# Altium schematic sheet ESP32_Component.SchDoc
size A3; SheetNumber: 1; SheetTotal: 1
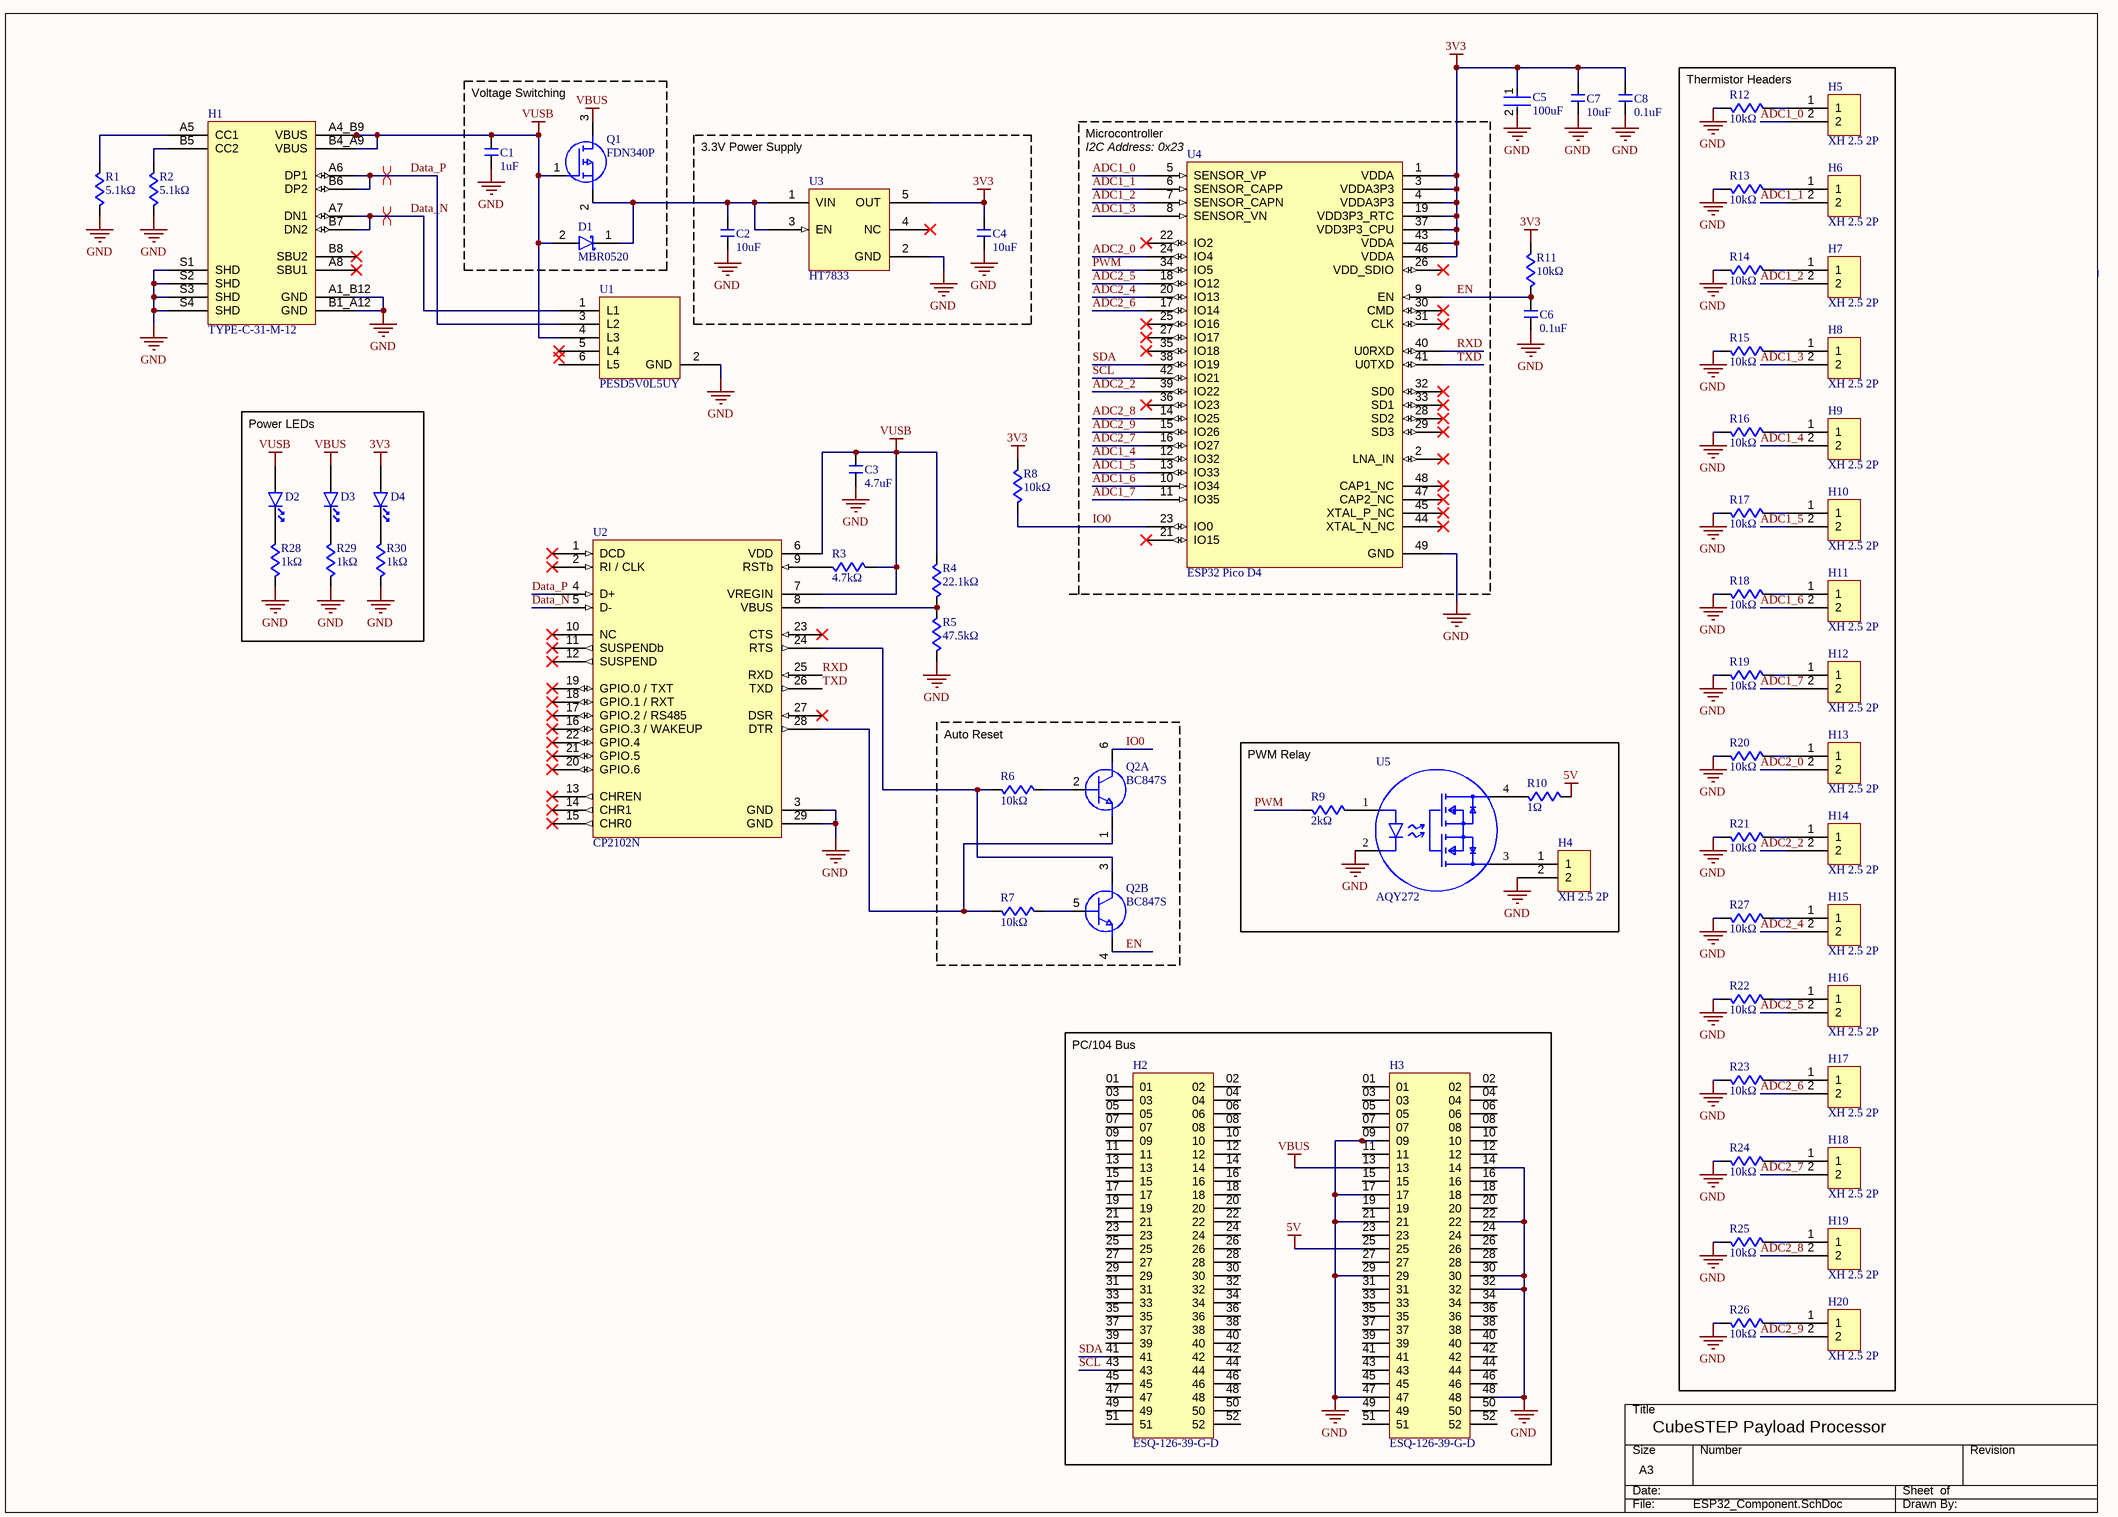
[diagram p0: ESP32_Component.SchDoc]

## Parts
C1  1uF  [FP-GRM155-0_05-MFG]
C2  10uF  [FP-GRM21B-0_1-MFG]
C3  4.7uF  [TCC0402X5R104M160AT-Footprint-1]
C4  10uF  [FP-GRM21B-0_1-MFG]
C5  100uF  [CAPC3216X16N]
C6  0.1uF  [TCC0402X5R104M160AT-Footprint-1]
C7  10uF  [FP-GRM21B-0_1-MFG]
C8  0.1uF  [TCC0402X5R104M160AT-Footprint-1]
D1  MBR0520  [FP-425-04-MFG]
D2  NCD0603R2  [LED0603]  (value not drawn)
D3  NCD0603R2  [LED0603]  (value not drawn)
D4  NCD0603R2  [LED0603]  (value not drawn)
H1  TYPE-C-31-M-12  [TYPE-C-31-M-12-Footprint-1]
H2  ESQ-126-39-G-D  [ESQ-126-39-G-D-Footprint-1]
H3  ESQ-126-39-G-D  [ESQ-126-39-G-D-Footprint-1]
H4  XH 2.5 2P  [W-2501R02P-N000-Footprint-1]
H5  XH 2.5 2P  [W-2501R02P-N000-Footprint-1]
H6  XH 2.5 2P  [W-2501R02P-N000-Footprint-1]
H7  XH 2.5 2P  [W-2501R02P-N000-Footprint-1]
H8  XH 2.5 2P  [W-2501R02P-N000-Footprint-1]
H9  XH 2.5 2P  [W-2501R02P-N000-Footprint-1]
H10  XH 2.5 2P  [W-2501R02P-N000-Footprint-1]
H11  XH 2.5 2P  [W-2501R02P-N000-Footprint-1]
H12  XH 2.5 2P  [W-2501R02P-N000-Footprint-1]
H13  XH 2.5 2P  [W-2501R02P-N000-Footprint-1]
H14  XH 2.5 2P  [W-2501R02P-N000-Footprint-1]
H15  XH 2.5 2P  [W-2501R02P-N000-Footprint-1]
H16  XH 2.5 2P  [W-2501R02P-N000-Footprint-1]
H17  XH 2.5 2P  [W-2501R02P-N000-Footprint-1]
H18  XH 2.5 2P  [W-2501R02P-N000-Footprint-1]
H19  XH 2.5 2P  [W-2501R02P-N000-Footprint-1]
H20  XH 2.5 2P  [W-2501R02P-N000-Footprint-1]
Q1  FDN340P  [FDN340P-Footprint-1]
Q2  BC847S  [BC847S-Footprint-1]  (parts A,B of 2)
R1  5.1kΩ  [RESC1005X04N]
R2  5.1kΩ  [RESC1005X04N]
R3  4.7kΩ  [RESC1005X04N]
R4  22.1kΩ  [RESC1005X04N]
R5  47.5kΩ  [RESC1005X04N]
R6  10kΩ  [RESC1005X04N]
R7  10kΩ  [RESC1005X04N]
R8  10kΩ  [RESC1005X04N]
R9  2kΩ  [RESC1005X04N]
R10  1Ω  [RESC5025X04N]
R11  10kΩ  [RESC1005X04N]
R12  10kΩ  [RESC1005X04N]
R13  10kΩ  [RESC1005X04N]
R14  10kΩ  [RESC1005X04N]
R15  10kΩ  [RESC1005X04N]
R16  10kΩ  [RESC1005X04N]
R17  10kΩ  [RESC1005X04N]
R18  10kΩ  [RESC1005X04N]
R19  10kΩ  [RESC1005X04N]
R20  10kΩ  [RESC1005X04N]
R21  10kΩ  [RESC1005X04N]
R22  10kΩ  [RESC1005X04N]
R23  10kΩ  [RESC1005X04N]
R24  10kΩ  [RESC1005X04N]
R25  10kΩ  [RESC1005X04N]
R26  10kΩ  [RESC1005X04N]
R27  10kΩ  [RESC1005X04N]
R28  1kΩ  [RESC1005X04N]
R29  1kΩ  [RESC1005X04N]
R30  1kΩ  [RESC1005X04N]
U1  PESD5V0L5UY  [PESD5V0L5UY-Footprint-1]
U2  CP2102N  [CP2102N-A02-GQFN28R-Footprint-1]
U3  HT7833  [HT7833-Footprint-1]
U4  ESP32 Pico D4  [ESP32-PICO-D4-Footprint-1]
U5  AQY272  [FP-AQY272-MFG]

## Blocks framed on the sheet
Thermistor Headers: H5-H20 R12-R27
Voltage Switching: C1 D1 Q1
3.3V Power Supply: C2 C4 U3
Power LEDs: D2-D4 R28-R30
Auto Reset: Q2 R6 R7
PWM Relay: H4 R9 R10 U5
PC/104 Bus: H2 H3

## Nets
3V3: C4.2 C5.1 C7.2 C8.2 D4.2(A) R8.2 R11.2 U3.5(OUT) U4.1(VDDA) U4.3(VDDA3P3) U4.4(VDDA3P3) U4.19(VDD3P3_RTC) U4.37(VDD3P3_CPU) U4.43(VDDA) U4.46(VDDA)
5V: H3.25 R10.2
GND: C1.2 C2.1 C3.2 C4.1 C5.2 C6.1 C7.1 C8.1 H1.A1_B12(GND) H1.B1_A12(GND) H1.S1(SHD) H1.S2(SHD) H1.S3(SHD) H1.S4(SHD) H3.09 H3.14 H3.17 H3.21 H3.22 H3.29 H3.30 H3.32 H3.47 H3.48 H4.2 R1.1 R2.1 R5.1 R12.2 R13.1 R14.1 R15.1 R16.1 R17.1 R18.1 R19.1 R20.1 R21.1 R22.1 R23.1 R24.1 R25.1 R26.1 R27.1 R28.1 R29.1 R30.1 U1.2(GND) U2.3(GND) U2.29(GND) U3.2(GND) U4.49(GND) U5.2(C)
VBUS: D3.2(A) H3.13 Q1.3(D)
VUSB: C1.1 C3.1 D1.2(A) D2.2(A) H1.A4_B9(VBUS) H1.B4_A9(VBUS) Q1.1(G) R3.2 R4.2 U1.4(L3) U2.6(VDD) U2.7(VREGIN)
ADC1_0: H5.2 U4.5(SENSOR_VP)
ADC1_1: H6.2 U4.6(SENSOR_CAPP)
ADC1_2: H7.2 U4.7(SENSOR_CAPN)
ADC1_3: H8.2 U4.8(SENSOR_VN)
ADC1_4: H9.2 U4.12(IO32)
ADC1_5: H10.2 U4.13(IO33)
ADC1_6: H11.2 U4.10(IO34)
ADC1_7: H12.2 U4.11(IO35)
ADC2_0: H13.2 U4.24(IO4)
ADC2_2: H14.2 U4.39(IO22)
ADC2_4: H15.2 U4.20(IO13)
ADC2_5: H16.2 U4.18(IO12)
ADC2_6: H17.2 U4.17(IO14)
ADC2_7: H18.2 U4.16(IO27)
ADC2_8: H19.2 U4.14(IO25)
ADC2_9: H20.2 U4.15(IO26)
Data_N: H1.A7(DN1) H1.B7(DN2) U1.1(L1) U2.5(D-)
Data_P: H1.A6(DP1) H1.B6(DP2) U1.3(L2) U2.4(D+)
EN: C6.2 Q2.4(S) R11.1 U4.9(EN)
IO0: Q2.6(D) R8.1 U4.23(IO0)
PWM: R9.1 U4.34(IO5)
RXD: U2.25(RXD) U4.40(U0RXD)
SCL: H2.43 U4.42(IO21)
SDA: H2.41 U4.38(IO19)
TXD: U2.26(TXD) U4.41(U0TXD)
NetC2_2: C2.2 D1.1(C) Q1.2(S) U3.1(VIN) U3.3(EN)
NetD2_1: D2.1(C) R28.2
NetD3_1: D3.1(C) R29.2
NetD4_1: D4.1(C) R30.2
NetH1_A5: H1.A5(CC1) R1.2
NetH1_B5: H1.B5(CC2) R2.2
NetH4_1: H4.1 U5.3(1_DRAIN)
NetH5_1: H5.1 R12.1
NetH6_1: H6.1 R13.2
NetH7_1: H7.1 R14.2
NetH8_1: H8.1 R15.2
NetH9_1: H9.1 R16.2
NetH10_1: H10.1 R17.2
NetH11_1: H11.1 R18.2
NetH12_1: H12.1 R19.2
NetH13_1: H13.1 R20.2
NetH14_1: H14.1 R21.2
NetH15_1: H15.1 R27.2
NetH16_1: H16.1 R22.2
NetH17_1: H17.1 R23.2
NetH18_1: H18.1 R24.2
NetH19_1: H19.1 R25.2
NetH20_1: H20.1 R26.2
NetQ2_1: Q2.1(S) R7.2 U2.28(DTR)
NetQ2_2: Q2.2(G) R6.1
NetQ2_3: Q2.3(D) R6.2 U2.24(RTS)
NetQ2_5: Q2.5(G) R7.1
NetR3_1: R3.1 U2.9(RSTb)
NetR4_1: R4.1 R5.2 U2.8(VBUS)
NetR9_2: R9.2 U5.1(A)
NetR10_1: R10.1 U5.4(2_DRAIN)

Not connected (* = marked no-connect by the designer): H1 A8(SBU1)* B8(SBU2)*; H2 01 02 03 04 05 06 07 08 09 10 11 12 13 14 15 16 17 18 19 20 21 22 23 24 25 26 27 28 29 30 31 32 33 34 35 36 37 38 39 40 42 44 45 46 47 48 49 50 51 52; H3 01 02 03 04 05 06 07 08 10 11 12 15 16 18 19 20 23 24 26 27 28 31 33 34 35 36 37 38 39 40 41 42 43 44 45 46 49 50 51 52; U1 5(L4)* 6(L5); U2 1(DCD)* 2(RI_/_CLK)* 10(NC)* 11(SUSPENDb)* 12(SUSPEND)* 13(CHREN)* 14(CHR1)* 15(CHR0)* 16(GPIO.3_/_WAKEUP)* 17(GPIO.2_/_RS485)* 18(GPIO.1_/_RXT)* 19(GPIO.0_/_TXT)* 20(GPIO.6)* 21(GPIO.5)* 22(GPIO.4)* 23(CTS)* 27(DSR)*; U3 4(NC)*; U4 2(LNA_IN)* 21(IO15)* 22(IO2)* 25(IO16)* 26(VDD_SDIO)* 27(IO17)* 28(SD2)* 29(SD3)* 30(CMD)* 31(CLK)* 32(SD0)* 33(SD1)* 35(IO18)* 36(IO23)* 44(XTAL_N_NC)* 45(XTAL_P_NC)* 47(CAP2_NC)* 48(CAP1_NC)*

## Layout directives
differential pair: Data_N, Data_P

## Notes on the sheet
- (near U4) Microcontroller
- (near U4) I2C Address: 0x23
- CubeSTEP Payload Processor
- DWG. NO.
- REV.
- SHT.
- REVISION
- DESCRIPTION
- DATE
- APPROVED
- THIS DOCUMENT AND THE DATA DISCLOSED HEREIN OR HEREWITH IS THE PROPERTY OF ALTIUM LIMITED AND MAY BE FREELY DISTRIBUTED IN WHOLE. NO RIGHTS ARE RESERVED OR EXPRESS OR IMPLIED WARANTEE GIVEN.
- ENG:
- DSN:
- APPROVALS
- PROJECT
- DOCUMENT REVISION:
- DESIGN ITEM:
- CHK:
- BOM:
- REFERENCE DOCUMENTS
- PROJECT REVISION:
- TITLE
- FAB DWG:
- PCB DWG:
- ASSY DWG:
- SCALE:
- SIZE
- C
- CAGE CODE
- FILE NAME
- DWG NO.
- SHEET
- OF
- REV

## Library data of the parts
C1 = CMP-00014-3: ±10% 16V X5R SMD 0402; Manufacturer: Murata Electronics; Part Number: GRM155R61C105KA12D; Type: Ceramic; Size Code: 0402; Tolerance: ±10%; Max Operating Temperature: 85°C; Capacitance: 1uF; Mount: Surface Mount; Temperature Coefficient: X5R; Overload Voltage: 16V; ComponentLink1URL: https://jlcpcb.com/partdetail/MurataElectronics-GRM155R61C105KA12D/C77006; Min Operating Temperature: -55°C; ComponentLink1Description: JLCPCB
C2 C4 C7 = CMP-00013-3: ±10% 16V B SMD 0805; Part Number: GRM21BB31C106KE15L; Manufacturer: Murata Electronics; Type: Ceramic; ComponentLink1URL: https://jlcpcb.com/partdetail/173698-GRM21BB31C106KE15L/C162317; Max Operating Temperature: 85°C; Capacitance: 10uF; ComponentLink1Description: JLCPCB; Temperature Coefficient: B; Mount: Surface Mount; Tolerance: ±10%; Overload Voltage: 16V; Min Operating Temperature: -25°C; Size Code: 0805
C3 = CMP-00010-8: ±20% 16V X5R SMD 0402; Type: Ceramic; Capacitance: 4.7uF; ComponentLink1Description: JLCPCB; Overload Voltage: 16V; ComponentLink1URL: https://jlcpcb.com/partdetail/-CM05X5R475M16AH/C255498; Tolerance: ±20%; Manufacturer: --; Size Code: 0402; Temperature Coefficient: X5R; Max Operating Temperature: 85°C; Part Number: CM05X5R475M16AH; Min Operating Temperature: -55°C; Mount: Surface Mount
C5 = CMP-00012-3: ±20% 6.3V X5R SMD 1206; Part Number: JMK316BJ107ML-T; Manufacturer: Taiyo Yuden; Type: Ceramic; Capacitance: 100uF; Tolerance: ±20%; ComponentLink1URL: https://jlcpcb.com/partdetail/TaiyoYuden-JMK316BJ107MLT/C87164; Size Code: 1206; Overload Voltage: 6.3V; Max Operating Temperature: 85°C; Mount: Surface Mount; Min Operating Temperature: -55°C; Temperature Coefficient: X5R; ComponentLink1Description: JLCPCB
C6 C8 = CMP-00011-4: ±20% 16V X5R SMD 0402; Part Number: TCC0402X5R104M160AT; Manufacturer: CCTC; Type: Ceramic; Mount: Surface Mount; Max Operating Temperature: 85°C; ComponentLink1URL: https://jlcpcb.com/partdetail/Cctc-TCC0402X5R104M160AT/C344190; Overload Voltage: 16V; Size Code: 0402; Capacitance: 0.1uF; ComponentLink1Description: JLCPCB; Min Operating Temperature: -55°C; Tolerance: ±20%; Temperature Coefficient: X5R
D1 = CMP-00018-4: Rectifier Diode, Schottky, 1 Phase, 1 Element, 0.5A, 20V V(RRM), Silicon; Number of Elements: 1; Forward Voltage-Max (VF): 385mV; Package Body Material: Plastic; Qualification Status: Not Qualified; Max Output Current: 500mA; Non-rep Pk Forward Current-Max: 5.5A; Time @ Peak Reflow Temperature-Max (s): 30s; Additional Feature: FREE WHEELING DIODE; Package Shape: Rectangular; Min Operating Temperature: -65°C; Terminal Finish: Tin; Package Style: SMALL OUTLINEMeter; Number of Pins: 2; Terminal Form: Gull Wing; Technology: SCHOTTKY; RoHS Compliant: Yes; Diode Type: RECTIFIER; Max Operating Temperature: 125°C; Moisture Sensitivity Level: 1; JESD-609 Code: e3; Peak Reflow Temperature (Cel): 260°C; JESD-30 Code: R-PDSO-G2; Surface Mount: Yes; Reach SVHC Compliant: Yes; Terminal Position: DUAL; Diode Element Material: SILICON; Rep Pk Reverse Voltage-Max: 20V
D2-D4 = CMP-00019-4: Colorless transparence 65mcd~150mcd 615nm~630nm -30℃~+85℃ Red 130° 65mW 0603 Light Emitting Diodes (LED) ROHS; Forward Voltage (VF): 1.6V~2.6V; Forward Current: 20mA; Power Dissipation: 65mW; Lumunous Intensity: 65mcd~150mcd; Emitted Color: Red; Dominant Wavelength: 615nm~630nm; Lens Color: Colorless transparence; Viewing Angle: 130°; Operating Temperature: -30℃~+85℃
H1 = CMP-00003-6: 5A 1 16P Female Type-C SMD USB Connectors ROHS
H2 H3 = CMP-00000-2: Board Connector, 52 Contact(s), 2 Row(s), Female, Straight, 0.1 inch Pitch, Solder Terminal, Locking, Black Insulator, Socket; Number Of PCB Rows: 2; Plating Thickness: 20uin; PCB Contact Row Spacing: 2.54mm; Mixed Contacts: No; Reference Standard: UL; Contact Resistance: 10mR; Contact Style: SQ PIN-SKT; Body Depth: 0.435inch; Contact Pattern: RECTANGULAR; Body Length: 2.62inch; Body Breadth: 0.195inch; Rated Current (Signal): 5.7A; Reliability: COMMERCIAL; Number of Contacts: 52; Polarization Key: POLARIZED HOUSING; Option: General Purpose; Number Of Connectors: 1; Mating Information: MULTIPLE MATING PARTS AVAILABLE; Contact Material: Bronze; Body/Shell Style: SOCKET; JESD-609 Code: e4; DIN Conformance: No; Max Operating Temperature: 125°C; PCB Contact Pattern: RECTANGULAR; Mating Contact Pitch: 0.1inch; Contact Finish - Termination: Gold (Au) - with Nickel (Ni) barrier; Insulation Color: Black; Reach SVHC Compliant: Yes; Terminal Length: 0.48inch; Termination: Solder; Number of Rows Loaded: 2; Min Operating Temperature: -55°C; Contact Finish - Mating: GOLD (20) OVER NICKEL (50); Mating Contact Row Spacing: 0.1inch; Connector Type: BOARD CONNECTOR; IEC Conformance: No; Filter Feature: No; RoHS Compliant: Yes; Contact Gender: Female; Terminal Pitch: 2.54mm; Mounting Style: STRAIGHT; Mount: Board; Insulation Material: Thermoplastic; Mounting Option 1: LOCKING; MIL Conformance: No
H4-H20 = CMP-00005-2: 1x2P XH 1 2.5mm 2 Brass Push-Pull,P=2.5mm Wire To Board / Wire To Wire Connector ROHS; Manufacturer: Ckmtw(Shenzhen Cankemeng); Assembly: Wave Soldering; Package: Push-Pull,P=2.5mm
Q1 = CMP-00008-2: SOT-23 MOSFETs ROHS; FET Technology: METAL-OXIDE SEMICONDUCTOR; Qualification Status: Not Qualified; Number of Elements: 1; Package Body Material: Plastic; Power Dissipation-Max (Abs): 500mW; Transistor Application: SWITCHING; DS Breakdown Voltage-Min: 20V; Drain Current-Max (Abs) (ID): 2A; Polarity/Channel Type: P-CHANNEL; Drain-source On Resistance-Max: 70R; Operating Mode: ENHANCEMENT MODE; Transistor Element Material: SILICON; Terminal Position: DUAL; Package Shape: Rectangular; JESD-609 Code: e3; Number of Pins: 3; Terminal Form: Gull Wing; Max Operating Temperature: 150°C; RoHS Compliant: Yes; Reach SVHC Compliant: Yes; Moisture Sensitivity Level: 1; Package Style: SMALL OUTLINEMeter; Terminal Finish: Tin; Drain Current-Max (ID): 2A; Surface Mount: Yes; JESD-30 Code: R-PDSO-G3
Q2 = CMP-00009-2: Small Signal Bipolar Transistor, 0.1A I(C), 45V V(BR)CEO, 2-Element, NPN, Silicon; Number of Elements: 2; Transition Frequency-Nom (fT): 250MHz; Package Body Material: Plastic; Qualification Status: Not Qualified; DC Current Gain-Min (hFE): 200; Transistor Application: AMPLIFIER; Max Collector Current: 100mA; JESD-30 Code: R-PDSO-G6; Terminal Position: DUAL; Number of Pins: 6; Max Operating Temperature: 150°C; Package Shape: Rectangular; Collector-emitter Voltage-Max: 45V; Terminal Form: Gull Wing; Transistor Element Material: SILICON; Package Style: SMALL OUTLINEMeter; Reach SVHC Compliant: Yes; Polarity/Channel Type: NPN; Surface Mount: Yes; RoHS Compliant: Yes; Moisture Sensitivity Level: 1
R1 R2 = CMP-00031-12: ±0.5% 62.5mW 50V SMD 0402; Manufacturer: UNI-ROYAL(Uniroyal Elec); Part Number: 0402WGD5101TCE; Temperature Coefficient: ±100ppm/°C; Mount: Surface Mount; Tolerance: ±0.5%; ComponentLink1URL: https://jlcpcb.com/partdetail/416226-0402WGD5101TCE/C423276; Size Code: 0402; ComponentLink1Description: JLCPCB; Resistor Type: Fixed; Overload Voltage: 50V; Resistance: 5.1kΩ; Power: 62.5mW; Min Operating Temperature: -55°C; Max Operating Temperature: 155°C; Type: Thick Film
R3 = CMP-00024-11: ±1% 62.5mW 50V SMD 0402; Manufacturer: YAGEO; Part Number: RC0402FR-074K7L; Temperature Coefficient: ±100ppm/°C; Resistance: 4.7kΩ; ComponentLink1Description: JLCPCB; Type: Thick Film; ComponentLink1URL: https://jlcpcb.com/partdetail/Yageo-RC0402FR074K7L/C105871; Tolerance: ±1%; Resistor Type: Fixed; Size Code: 0402; Overload Voltage: 50V; Power: 62.5mW; Min Operating Temperature: -55°C; Mount: Surface Mount; Max Operating Temperature: 155°C
R4 = CMP-00022-11: ±1% 62.5mW50V SMD 0402; Part Number: RC0402FR-0722K1L; Manufacturer: YAGEO; Power: 62.5mW; Temperature Coefficient: ±100ppm/°C; Overload Voltage: 50V; Type: Thick Film; ComponentLink1URL: https://jlcpcb.com/partdetail/Yageo-RC0402FR0722K1L/C163478; Max Operating Temperature: 155°C; ComponentLink1Description: JLCPCB; Tolerance: ±1%; Min Operating Temperature: -55°C; Resistor Type: Fixed; Mount: Surface Mount; Resistance: 22.1kΩ; Size Code: 0402
R5 = CMP-00029-10: ±1% 62.5mW 50V SMD 0402; Manufacturer: YAGEO; Part Number: RC0402FR-0747K5L; Temperature Coefficient: ±100ppm/°C; Size Code: 0402; Type: Thick Film; Resistance: 47.5kΩ; Overload Voltage: 50V; Tolerance: ±1%; Power: 62.5mW; Mount: Surface Mount; Max Operating Temperature: 155°C; ComponentLink1URL: https://jlcpcb.com/partdetail/Yageo-RC0402FR0747K5L/C137974; ComponentLink1Description: JLCPCB; Resistor Type: Fixed; Min Operating Temperature: -55°C
R6-R8 R11-R27 = CMP-00021-11: ±1% 62.5mW 50V SMD 0402; Manufacturer: FH (Guangdong Fenghua Advanced Tech); Temperature Coefficient: ±200ppm/℃; Part Number: RC-02W1002FT; ComponentLink1URL: https://jlcpcb.com/partdetail/251116-RC02W1002FT/C258091; Overload Voltage: 50V; Max Operating Temperature: 155°C; Size Code: 0402; Resistor Type: Fixed; Min Operating Temperature: -55°C; Power: 62.5mW; Resistance: 10kΩ; Type: Thick Film; ComponentLink1Description: JLCPCB; Tolerance: ±1%; Mount: Surface Mount
R9 = CMP-00027-11: ±1% 62.5mW 50V SMD 0402; Part Number: CR0402FF2001G; Manufacturer: LIZ Elec; Temperature Coefficient: ±200ppm/℃; Overload Voltage: 50V; ComponentLink1Description: JLCPCB; ComponentLink1URL: https://jlcpcb.com/partdetail/LizElec-CR0402FF2001G/C100291; Type: Thick Film; Max Operating Temperature: 125°C; Resistor Type: Fixed; Power: 62.5mW; Resistance: 2kΩ; Size Code: 0402; Min Operating Temperature: -55°C; Tolerance: ±1%; Mount: Surface Mount
R10 = CMP-00017-8: ±5% 0.75W 200V SMD 2010; Part Number: RTT201R00FTE; Manufacturer: RALEC; Temperature Coefficient: ±400ppm/°C; Power: 750mW; Type: Thick Film; ComponentLink1URL: https://jlcpcb.com/partdetail/Ralec-RTT201R00FTE/C159258; ComponentLink1Description: JLCPCB; Overload Voltage: 200V; Max Operating Temperatrure: 155°C; Resistance: 1Ω; Min Operating Temperature: -55°C; Tolerance: ±5%; Mount: Surface Mount; Size Code: 2010; Resistor Type: Fixed
R28-R30 = CMP-00025-11: ±1% 62.5mW 50V SMD 0402; Manufacturer: YAGEO; Part Number: RC0402FR-071KL; Temperature Coefficient: ±100ppm/°C; ComponentLink1URL: https://jlcpcb.com/partdetail/Yageo-RC0402FR071KL/C106235; Power: 62.5mW; Size Code: 0402; Max Operating Temperature: 155°C; Min Operating Temperature: -55°C; Mount: Surface Mount; Resistor Type: Fixed; ComponentLink1Description: JLCPCB; Resistance: 1kΩ; Type: Thick Film; Overload Voltage: 50V; Tolerance: ±1%
U1 = CMP-00004-3: Trans Voltage Suppressor Diode, 25W, 5V V(RWM), Unidirectional, 5 Element, Silicon; Manufacturer: UMW(Youtai Semiconductor Co., Ltd.); ComponentLink1URL: https://jlcpcb.com/partdetail/2985836-PESD5V0L5UY/C2831528; ComponentLink1Description: JLCPCB; Part Number: PESD5V0L5UY
U2 = CMP-00002-7: USB-to-UART bridge controller; Manufacturer: SILICON LABS; Part Number: CP2102N-A02-GQFN28R; ComponentLink1URL: https://jlcpcb.com/partdetail/SiliconLabs-CP2102N_A02GQFN28R/C964632; ComponentLink1Description: JLCPCB
U3 = CMP-00007-3: SOT-23-5 Linear Voltage Regulators (LDO) ROHS; Manufacturer: TECH PUBLIC; Part Number: HT7833; ComponentLink1Description: JLCPCB; ComponentLink1URL: https://jlcpcb.com/partdetail/TECHPUBLIC-HT7833/C3011187
U4 = CMP-00001-5: System-on-Chip integrating an ESP32 chip together with a 4 MB SPI flash; Manufacturer: Espressif Systems; Part Number: ESP32-PICO-D4; ComponentLink1Description: JLCPCB; ComponentLink1URL: https://jlcpcb.com/partdetail/EspressifSystems-ESP32_PICOD4/C193707
U5 = CMP-00016-2: Solid State Relays 1.25V 60V 0.11Ω 2A AC,DC DIP-4 - MOS Output (PhotoMOS) ROHS 1 Form A(SPST-NO); On-state Resistance-Max: 180mR; Isolation Voltage-Max: 2.5kV; Control Voltage: 1.16V; Number of Elements: 1; Output Circuit Type: MOSFET; Forward Current-Max: 50mA; Overall Height: 3.9mm; Control Current: 1mA; Optoelectronic Device Type: TRANSISTOR OUTPUT SSR; JESD-609 Code: e3; Input Type: DC; Reach SVHC Compliant: Yes; On-State Current-Max: 2A; Min Operating Temperature: -40°C; RoHS Compliant: Yes; Max Operating Temperature: 85°C; Length: 9.3mm; Terminal Finish: Tin